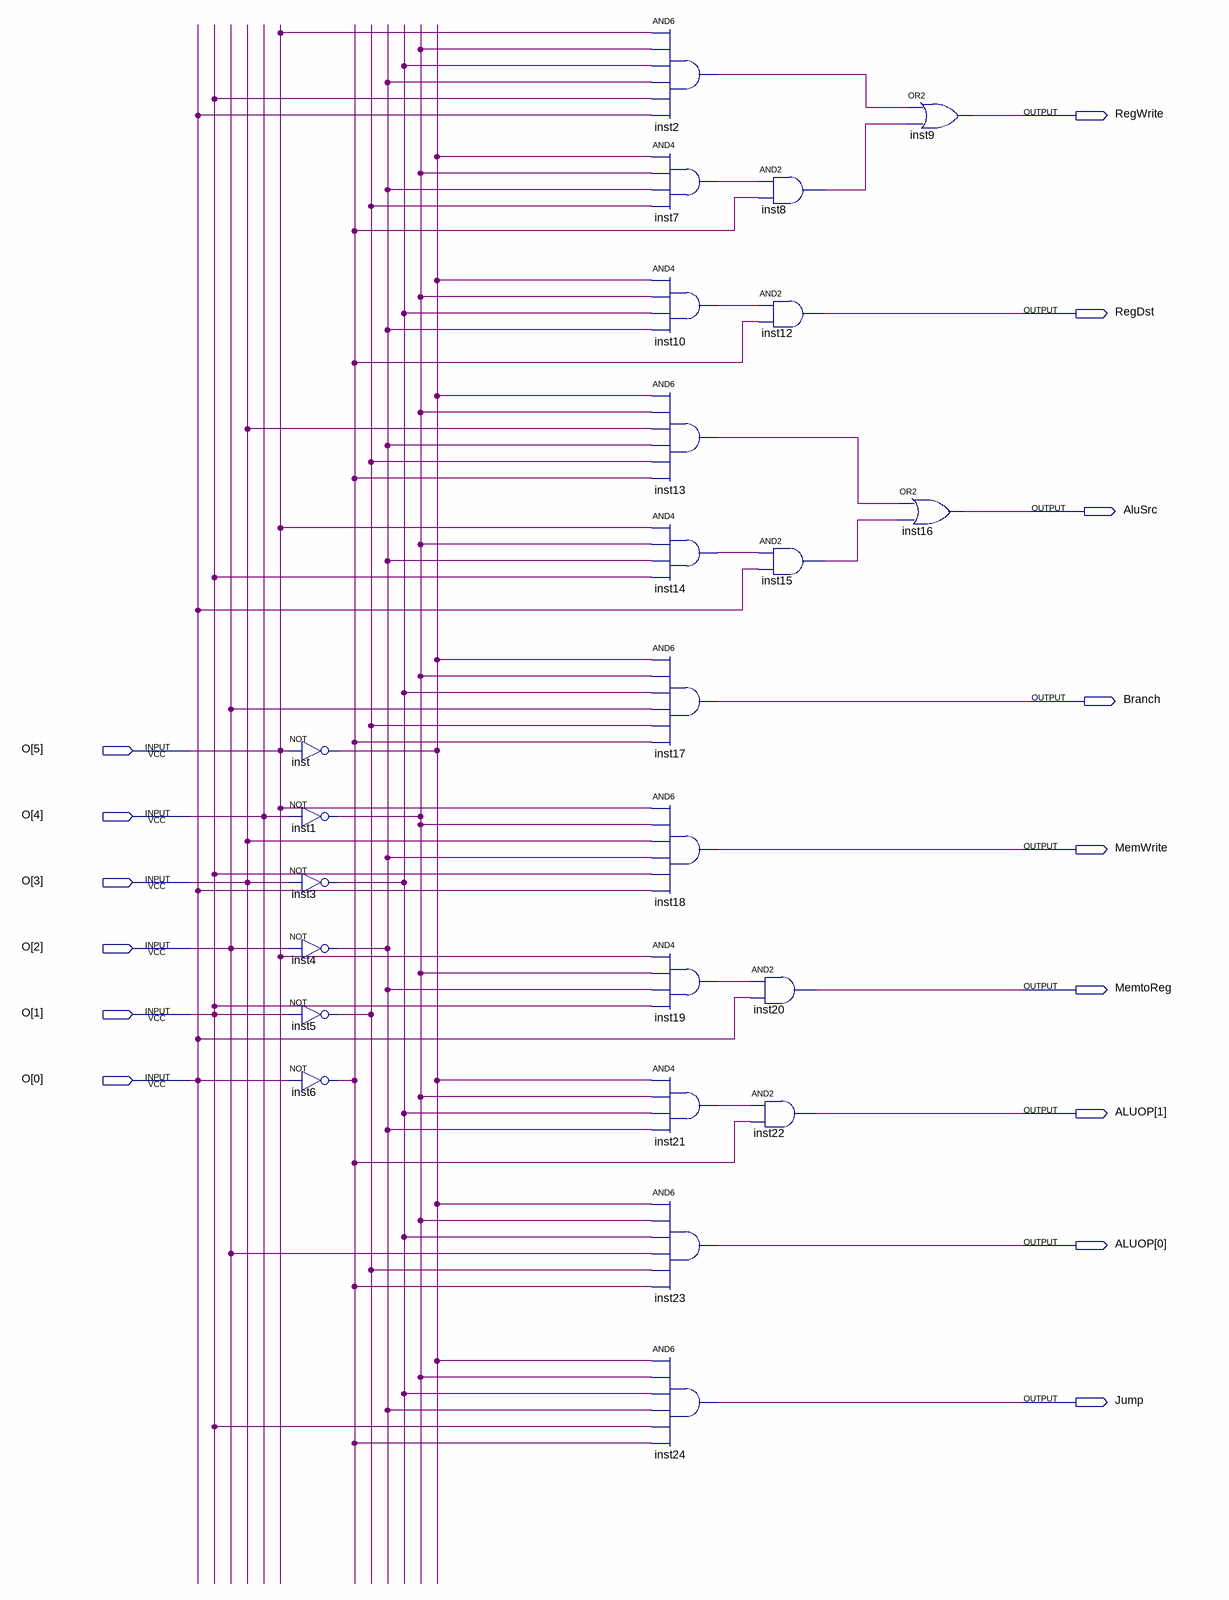
[diagram p0: schematic sheet]
// Quartus schematic MainDecoder.bdf as structural Verilog: 24 symbols, 15 pins
module MainDecoder (
  input  [5:0] O,
  output RegWrite,
  output RegDst,
  output AluSrc,
  output Branch,
  output MemWrite,
  output MemtoReg,
  output [1:0] ALUOP,
  output Jump
);

  wire inst1_out, inst2_out, inst3_out, inst4_out, inst5_out, inst6_out, inst7_out, inst8_out, inst10_out,
       inst13_out, inst14_out, inst15_out, inst19_out, inst21_out, inst_out;

  not inst (inst_out, O[5]);
  not inst1 (inst1_out, O[4]);
  not inst3 (inst3_out, O[3]);
  not inst4 (inst4_out, O[2]);
  not inst5 (inst5_out, O[1]);
  not inst6 (inst6_out, O[0]);
  and inst2 (inst2_out, O[5], inst1_out, inst3_out, inst4_out, O[1], O[0]);
  and inst7 (inst7_out, inst_out, inst1_out, inst4_out, inst5_out);
  and inst10 (inst10_out, inst_out, inst1_out, inst3_out, inst4_out);
  and inst13 (inst13_out, inst_out, inst1_out, O[3], inst4_out, inst5_out, inst6_out);
  and inst14 (inst14_out, O[5], inst1_out, inst4_out, O[1]);
  and inst17 (Branch, inst_out, inst1_out, inst3_out, O[2], inst5_out, inst6_out);
  and inst18 (MemWrite, O[5], inst1_out, O[3], inst4_out, O[1], O[0]);
  and inst19 (inst19_out, O[5], inst1_out, inst4_out, O[1]);
  and inst21 (inst21_out, inst_out, inst1_out, inst3_out, inst4_out);
  and inst23 (ALUOP[0], inst_out, inst1_out, inst3_out, O[2], inst5_out, inst6_out);
  and inst24 (Jump, inst_out, inst1_out, inst3_out, inst4_out, O[1], inst6_out);
  and inst8 (inst8_out, inst7_out, inst6_out);
  and inst12 (RegDst, inst10_out, inst6_out);
  and inst15 (inst15_out, inst14_out, O[0]);
  and inst20 (MemtoReg, inst19_out, O[0]);
  and inst22 (ALUOP[1], inst21_out, inst6_out);
  or inst9 (RegWrite, inst2_out, inst8_out);
  or inst16 (AluSrc, inst13_out, inst15_out);
endmodule
